# EAGLE design mcp_basic (EAGLE 8.3.2)
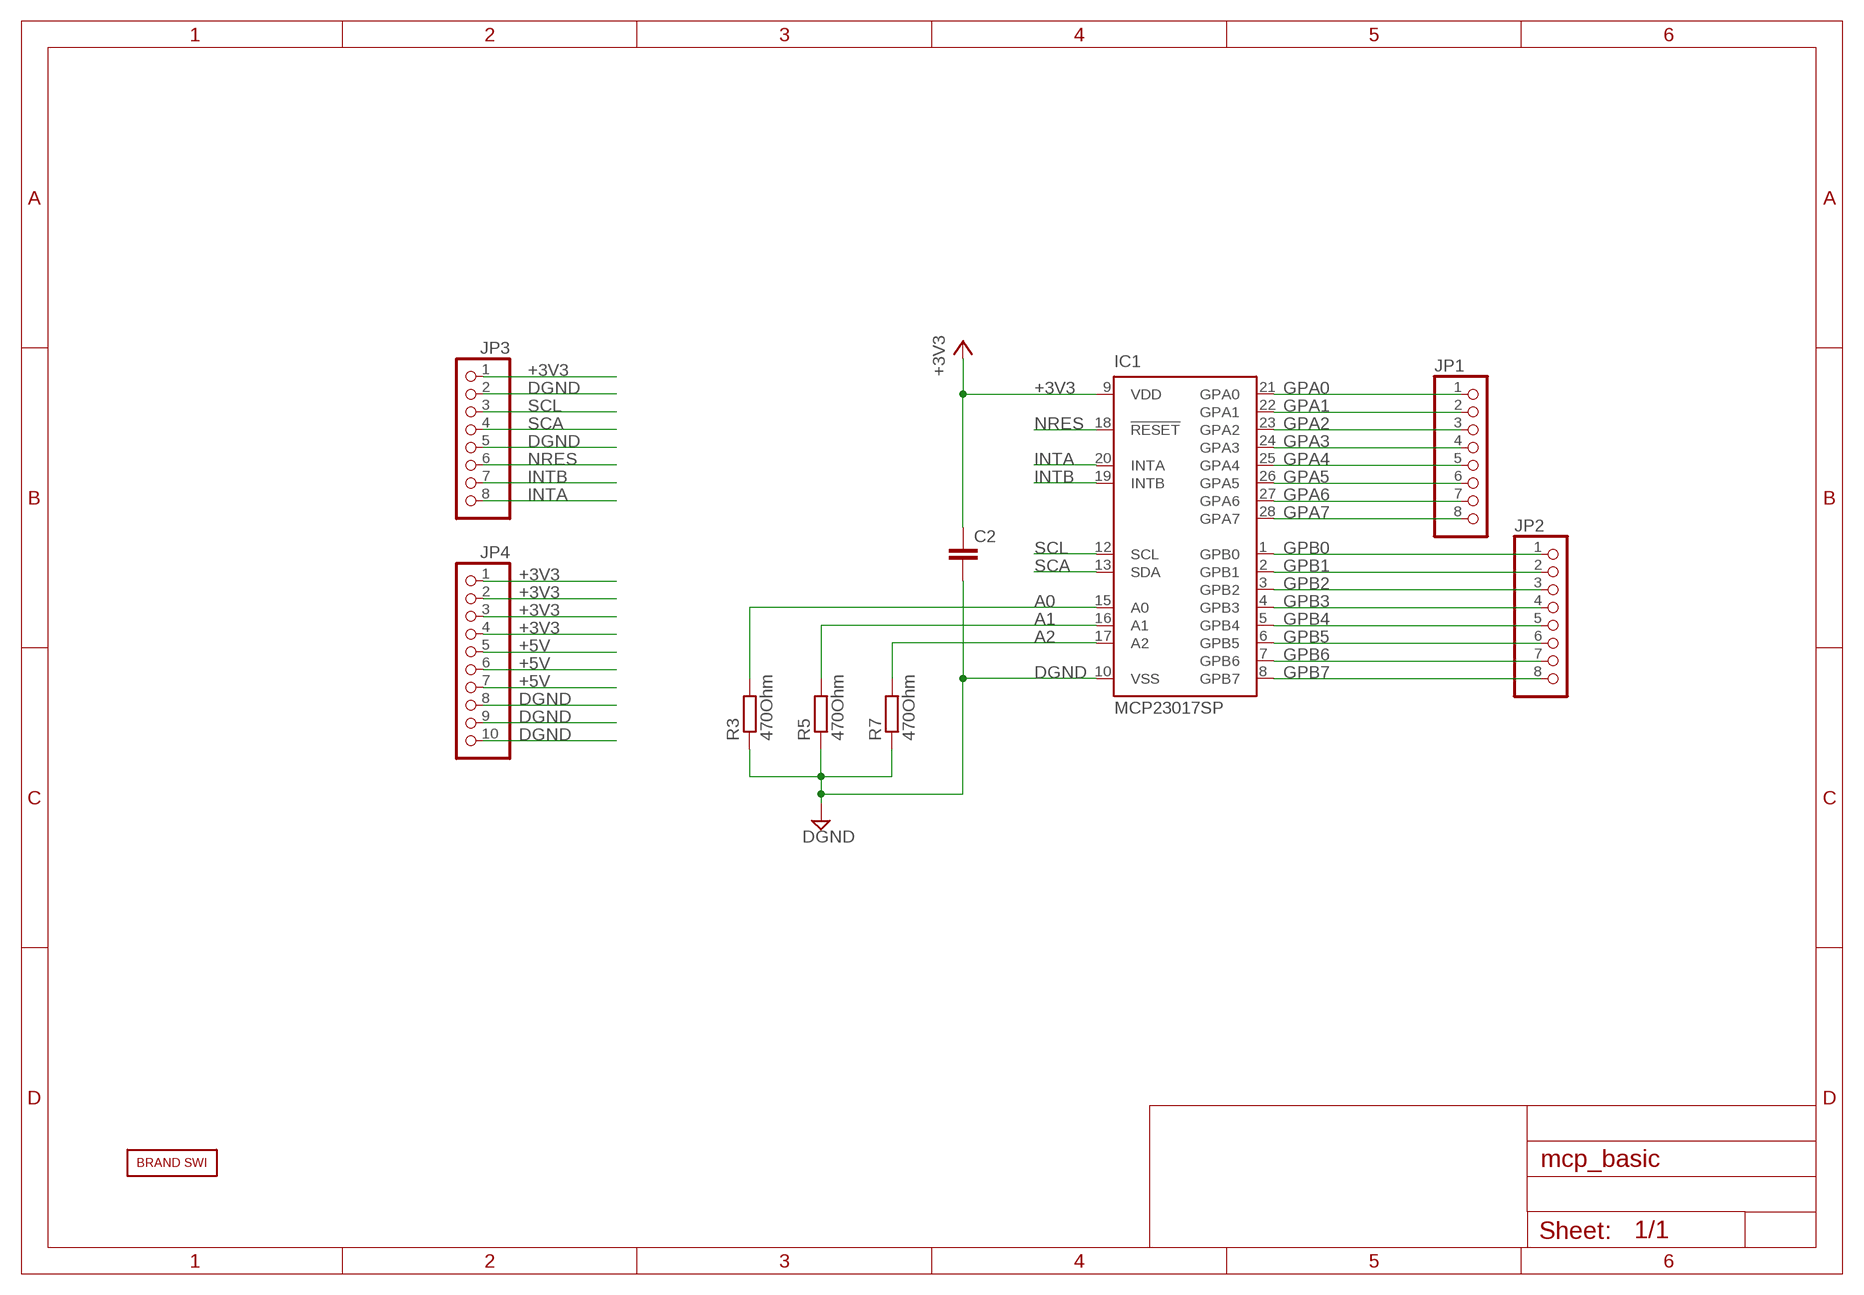
[diagram p0: schematic, sheet 1]

## Parts
C2  C-EUC1210  [C1210]
IC1  MCP23017SP  [DIL28-3]
JP1  PINHD-1X8  [1X08]
JP2  PINHD-1X8  [1X08]
JP3  PINHD-1X8  [1X08]
JP4  PINHD-1X10  [1X10]
R3  470Ohm  R-EU_R0805  [R0805]
R5  470Ohm  R-EU_R0805  [R0805]
R7  470Ohm  R-EU_R0805  [R0805]
U$2  BRAND_SWI5X7  [BRAND_SWI_5X7]

## Nets
+3V3: C2.1 IC1.9(VDD) JP3.1 JP4.1 JP4.2 JP4.3 JP4.4
+5V: JP4.5 JP4.6 JP4.7
A0: IC1.15(A0) R3.2
A1: IC1.16(A1) R5.2
A2: IC1.17(A2) R7.2
DGND: C2.2 IC1.10(VSS) JP3.2 JP3.5 JP4.8 JP4.9 JP4.10 R3.1 R5.1 R7.1
GPA0: IC1.21(GPA0) JP1.1
GPA1: IC1.22(GPA1) JP1.2
GPA2: IC1.23(GPA2) JP1.3
GPA3: IC1.24(GPA3) JP1.4
GPA4: IC1.25(GPA4) JP1.5
GPA5: IC1.26(GPA5) JP1.6
GPA6: IC1.27(GPA6) JP1.7
GPA7: IC1.28(GPA7) JP1.8
GPB0: IC1.1(GPB0) JP2.1
GPB1: IC1.2(GPB1) JP2.2
GPB2: IC1.3(GPB2) JP2.3
GPB3: IC1.4(GPB3) JP2.4
GPB4: IC1.5(GPB4) JP2.5
GPB5: IC1.6(GPB5) JP2.6
GPB6: IC1.7(GPB6) JP2.7
GPB7: IC1.8(GPB7) JP2.8
INTA: IC1.20(INTA) JP3.8
INTB: IC1.19(INTB) JP3.7
NRES: IC1.18(!RESET) JP3.6
SCA: IC1.13(SDA) JP3.4
SCL: IC1.12(SCL) JP3.3

## Library data of the parts
C2 = rcl:C-EU: CAPACITOR, European symbol
IC1 = SWI_COMMONS:MCP23017: http://ww1.microchip.com/downloads/en/DeviceDoc/21952a.pdf Source: http://ww1.microchip.com/downloads/en/DeviceDoc/21952a.pdf; MF: MICROCHIP; MPN: MCP23017-E/SP; OC_FARNELL: 1332088; OC_NEWARK: 31K2959
JP1-JP3 = pinhead:PINHD-1X8: PIN HEADER
JP4 = pinhead:PINHD-1X10: PIN HEADER
R3 R5 R7 = rcl:R-EU_: RESISTOR, European symbol
U$2 = BRAND_SWI:BRAND_SWI

## Board
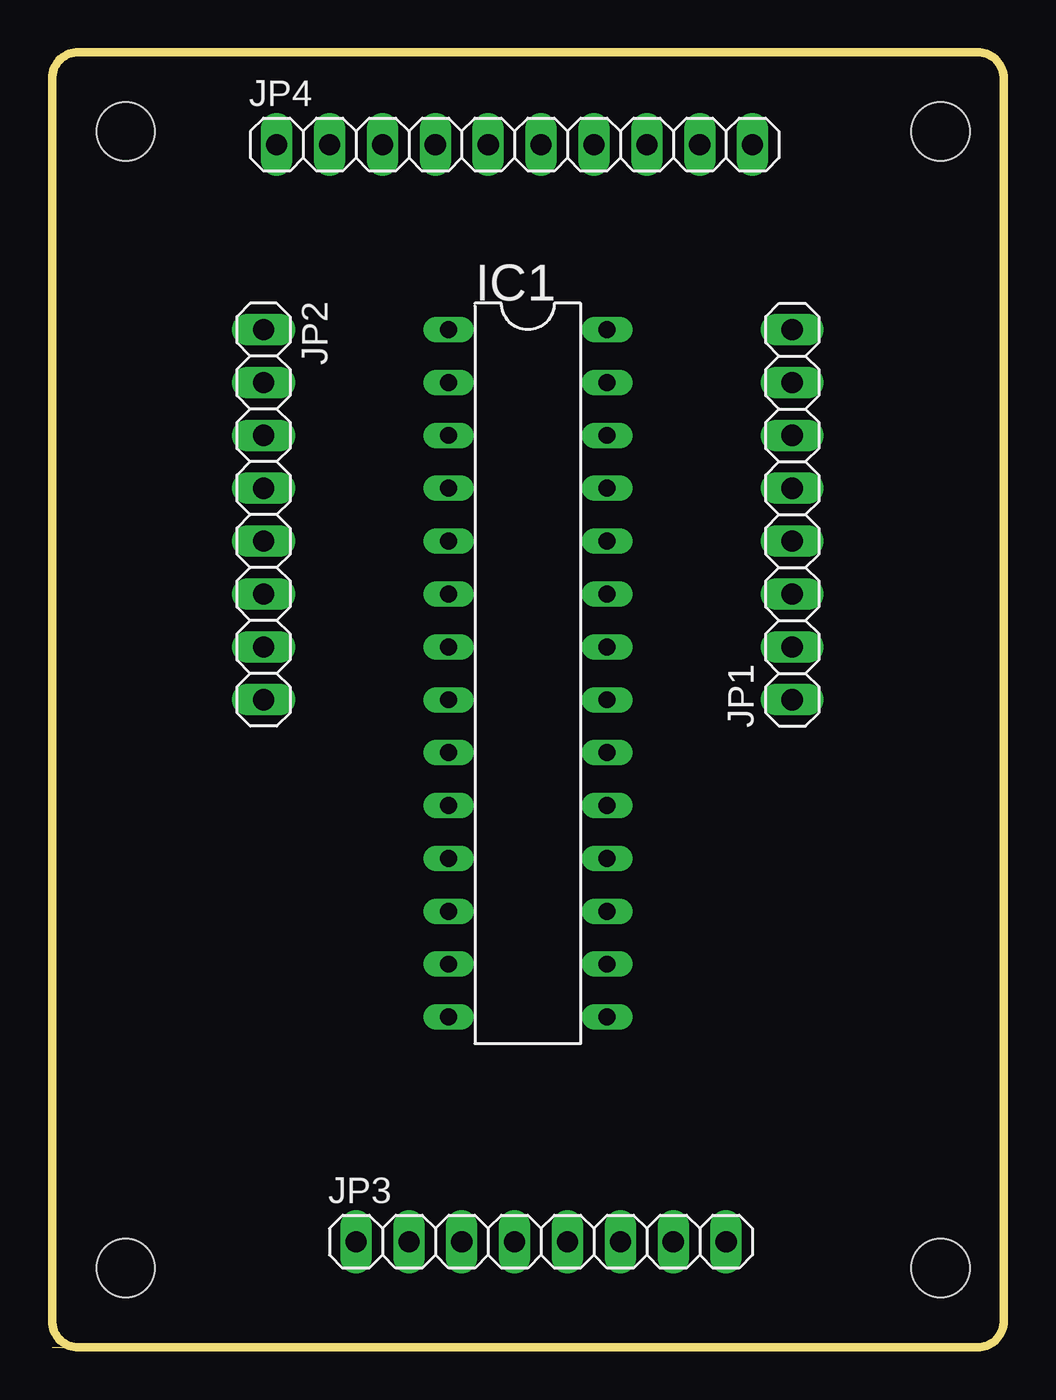
[diagram p1: board, top side]
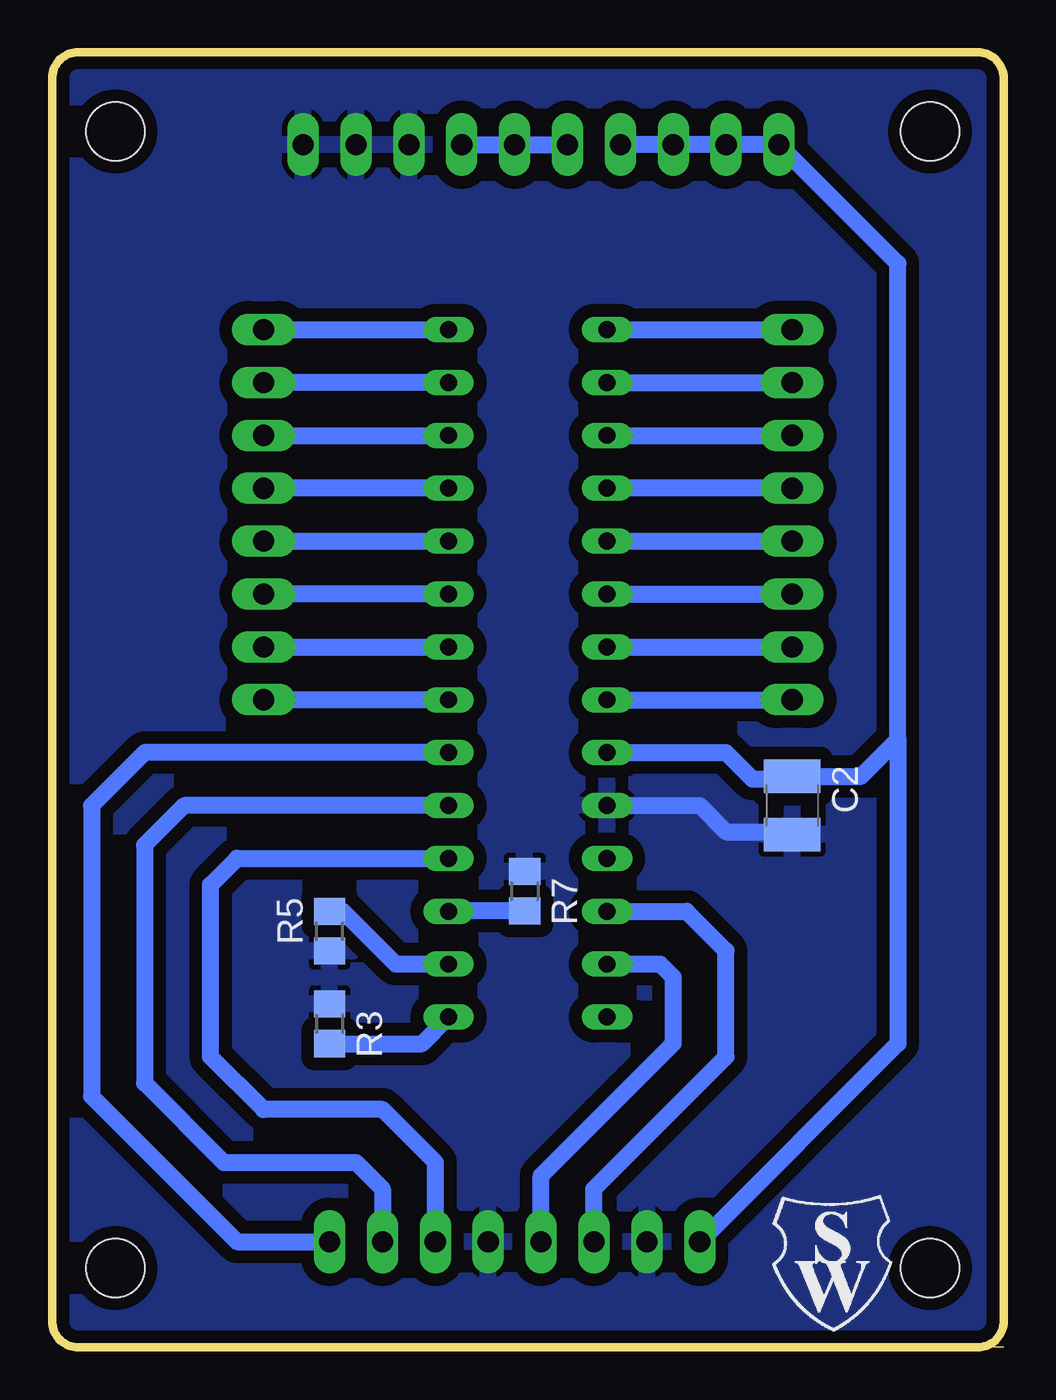
[diagram p2: board, bottom side, seen from below]

Size 45.72 x 62.23 mm. Coordinates in mm from the lower left corner, seen from the top.
Outline: 0,0 1.27,0
Outline: 1.27,0 2.03,0
Outline: 28.45,0 31.42,0
Outline: 1.27,0 44.45,0 arc90 45.72,1.27 45.72,60.96 arc90 44.45,62.23 1.27,62.23 arc90 0,60.96 0,1.27 arc90 1.27,0
Copper layers (1*16): Top 0.035mm / dielectric 1.6mm / Bottom 0.035mm
Design rules "Elecrow_2-layer_PCB_eagle_rule *": minimum track width 12mil, minimum drill 12mil, track to track 6mil, track to pad 6mil, pad to pad 6mil, via to via 8mil, smd to smd 0mil, copper to edge 20mil, drill to drill 10mil, minimum pad ring 6mil, minimum via ring 6mil, stop-mask expansion 0mil, vias tented up to drill 100mil, thermal gap 10mil
Holes 2.8 mm at 3.54,58.42 42.68,58.42 42.68,3.81 3.54,3.81

### Footprints (pad centres in the part's own frame; a part is rotated, then mirrored left to right if it is on the bottom)
C1210 = smd 1.6 x 2.7: 1 -1.4,0; 2 1.4,0
DIL28-3 = drill 0.813 long: 1 -16.51,-3.81; 2 -13.97,-3.81; 3 -11.43,-3.81; 4 -8.89,-3.81; 5 -6.35,-3.81; 6 -3.81,-3.81; 7 -1.27,-3.81; 8 1.27,-3.81; 9 3.81,-3.81; 10 6.35,-3.81; 11 8.89,-3.81; 12 11.43,-3.81; 13 13.97,-3.81; 14 16.51,-3.81; 15 16.51,3.81; 16 13.97,3.81; 17 11.43,3.81; 18 8.89,3.81; 19 6.35,3.81; 20 3.81,3.81; 21 1.27,3.81; 22 -1.27,3.81; 23 -3.81,3.81; 24 -6.35,3.81; 25 -8.89,3.81; 26 -11.43,3.81; 27 -13.97,3.81; 28 -16.51,3.81
1X08 = drill 1.016 long: 1 -8.89,0; 2 -6.35,0; 3 -3.81,0; 4 -1.27,0; 5 1.27,0; 6 3.81,0; 7 6.35,0; 8 8.89,0
1X10 = drill 1.016 long: 1 -11.43,0; 2 -8.89,0; 3 -6.35,0; 4 -3.81,0; 5 -1.27,0; 6 1.27,0; 7 3.81,0; 8 6.35,0; 9 8.89,0; 10 11.43,0
R0805 = smd 1.3 x 1.5: 1 -0.95,0; 2 0.95,0

### Placement (x,y rotation side)
C2  10.16,26.04 270 bottom
IC1  22.86,32.38 270 top
JP1  35.56,40.01 90 top
JP2  10.16,40.01 270 top
JP3  23.5,5.08 0 top
JP4  22.23,57.78 0 top
R3  32.38,15.54 270 bottom
R5  32.38,19.99 90 bottom
R7  23.01,21.92 270 bottom
U$2  11.3,0.64 0 bottom

### Tracks (layer width: path | path; a pad name or v marks a point on that pad's centre or on a via)
+3V3
  Bottom 0.813: IC1.9 13.34,28.57 12.06,27.3 10.29,27.3 C2.1 6.86,27.43 5.08,29.21 | JP3.1 5.08,14.61 5.08,29.21 | 5.08,29.21 5.08,52.07 JP4.1 JP4.2 JP4.3 JP4.4
+5V
  Bottom 0.813: JP4.5 JP4.6 JP4.7
A0
  Bottom 0.813: R3.2 27.95,14.6 IC1.15
A1
  Bottom 0.813: R5.2 31.73,20.94 29.21,18.41 IC1.16
A2
  Bottom 0.813: R7.2 26.66,20.97 IC1.17
DGND
  Bottom 0.813: IC1.10 14.61,26.04 13.34,24.77 10.29,24.77 C2.2
  pour Bottom (isolate 0.61): 0,59.69 arc-90 2.54,62.23 3.81,62.23 43.18,62.23 arc-90 45.72,59.69 45.72,2.54 arc-90 43.18,0 41.91,0 1.27,0 arc-90 0,1.27 0,2.54
GPA0
  Bottom 0.813: IC1.21 JP1.1
GPA1
  Bottom 0.813: JP1.2 IC1.22
GPA2
  Bottom 0.813: IC1.23 JP1.3
GPA3
  Bottom 0.813: JP1.4 IC1.24
GPA4
  Bottom 0.813: IC1.25 JP1.5
GPA5
  Bottom 0.813: JP1.6 IC1.26
GPA6
  Bottom 0.813: IC1.27 JP1.7
GPA7
  Bottom 0.813: JP1.8 IC1.28
GPB0
  Bottom 0.813: IC1.1 JP2.1
GPB1
  Bottom 0.813: IC1.2 JP2.2
GPB2
  Bottom 0.813: IC1.3 JP2.3
GPB3
  Bottom 0.813: JP2.4 IC1.4
GPB4
  Bottom 0.813: IC1.5 JP2.5
GPB5
  Bottom 0.813: IC1.6 JP2.6
GPB6
  Bottom 0.813: IC1.7 JP2.7
GPB7
  Bottom 0.813: IC1.8 JP2.8 | JP2.8 9.53,31.11 JP2.8
INTA
  Bottom 0.813: IC1.20 41.27,28.57 43.81,26.04 43.81,12.06 36.83,5.08 JP3.8
INTB
  Bottom 0.813: IC1.19 39.37,26.04 41.27,24.13 41.27,12.7 37.47,8.89 31.11,8.89 29.84,7.62 JP3.7
NRES
  Bottom 0.813: JP3.6 27.3,8.89 29.84,11.43 35.56,11.43 38.1,13.97 38.1,22.23 36.83,23.5 IC1.18
SCA
  Bottom 0.813: IC1.13 16.51,18.41 15.88,17.78 15.88,14.61 22.23,8.26 JP3.4
SCL
  Bottom 0.813: IC1.12 15.24,20.95 13.97,19.68 13.34,19.05 13.34,13.97 19.68,7.62 JP3.3

### Text on the board
bRestrict: PN39022R1B1 | WSHIELD_MCP_BASIC